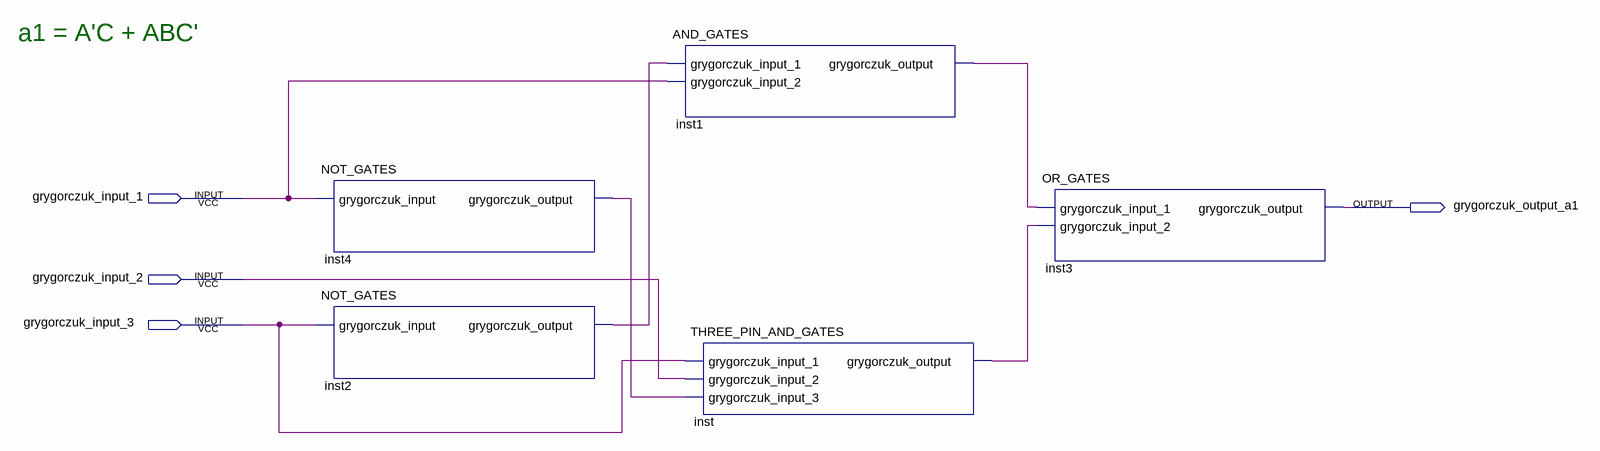
[diagram p0: schematic sheet]
// Quartus schematic RESET_A1.bdf as structural Verilog: 5 symbols, 4 pins
module RESET_A1 (
  input  grygorczuk_input_1,
  input  grygorczuk_input_2,
  input  grygorczuk_input_3,
  output grygorczuk_output_a1
);

  wire inst1_grygorczuk_output, inst2_grygorczuk_output, inst4_grygorczuk_output, inst_grygorczuk_output;

  NOT_GATES inst4 (.grygorczuk_input(grygorczuk_input_1), .grygorczuk_output(inst4_grygorczuk_output));
  NOT_GATES inst2 (.grygorczuk_input(grygorczuk_input_3), .grygorczuk_output(inst2_grygorczuk_output));
  AND_GATES inst1 (
    .grygorczuk_input_1(inst2_grygorczuk_output), .grygorczuk_input_2(grygorczuk_input_1),
    .grygorczuk_output(inst1_grygorczuk_output));
  THREE_PIN_AND_GATES inst (
    .grygorczuk_input_1(grygorczuk_input_3), .grygorczuk_input_2(grygorczuk_input_2),
    .grygorczuk_input_3(inst4_grygorczuk_output), .grygorczuk_output(inst_grygorczuk_output));
  OR_GATES inst3 (
    .grygorczuk_input_1(inst1_grygorczuk_output), .grygorczuk_input_2(inst_grygorczuk_output),
    .grygorczuk_output(grygorczuk_output_a1));

  // Notes on the sheet:
  //   a1 = A'C + ABC'
endmodule
